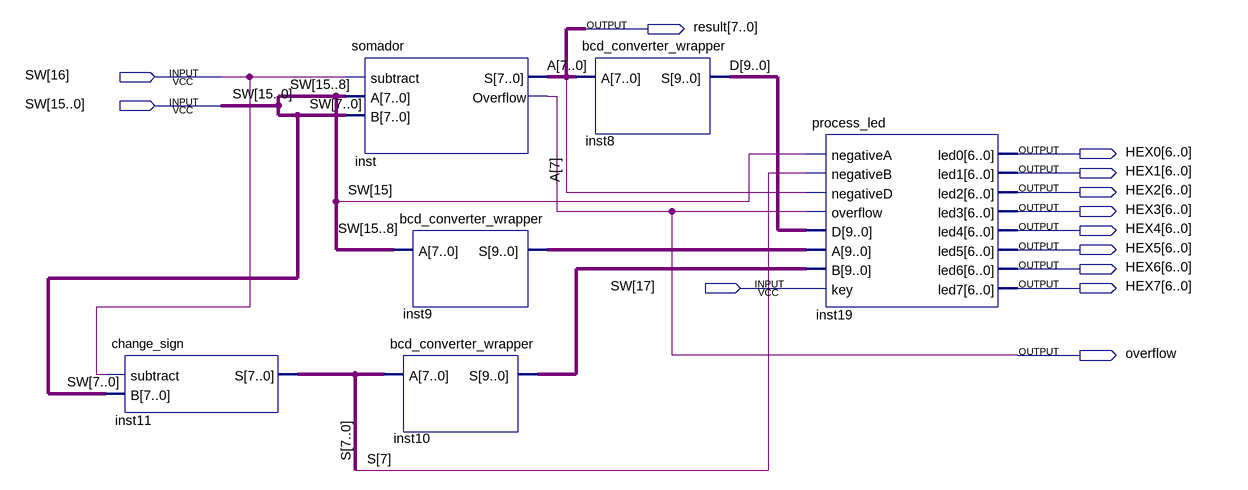
[diagram p0: schematic sheet]
// Quartus schematic pre_projeto.bdf as structural Verilog: 6 symbols, 13 pins
module pre_projeto (
  input  [17:0] SW,
  output [7:0] result,
  output [6:0] HEX0,
  output [6:0] HEX1,
  output [6:0] HEX2,
  output [6:0] HEX3,
  output [6:0] HEX4,
  output [6:0] HEX5,
  output [6:0] HEX6,
  output [6:0] HEX7,
  output overflow
);

  wire [7:0] S;
  wire [9:0] D, inst9_s, inst10_s;

  change_sign inst11 (.subtract(SW[16]), .B(SW[7:0]), .S(S));
  somador inst (.subtract(SW[16]), .A(SW[15:8]), .B(SW[7:0]), .S(result), .Overflow(overflow));
  bcd_converter_wrapper inst9 (.A(SW[15:8]), .S(inst9_s));
  bcd_converter_wrapper inst10 (.A(S), .S(inst10_s));
  bcd_converter_wrapper inst8 (.A(result), .S(D));
  process_led inst19 (
    .negativeA(SW[15]), .negativeB(S[7]), .negativeD(result[7]), .overflow(overflow), .D(D), .A(inst9_s),
    .B(inst10_s), .key(SW[17]), .led0(HEX0), .led1(HEX1), .led2(HEX2), .led3(HEX3), .led4(HEX4), .led5(HEX5),
    .led6(HEX6), .led7(HEX7));

  // Other names for the same wires on the sheet: A[7:0] = result
endmodule
